# Altium schematic sheet FP_Harness.SchDoc
size A
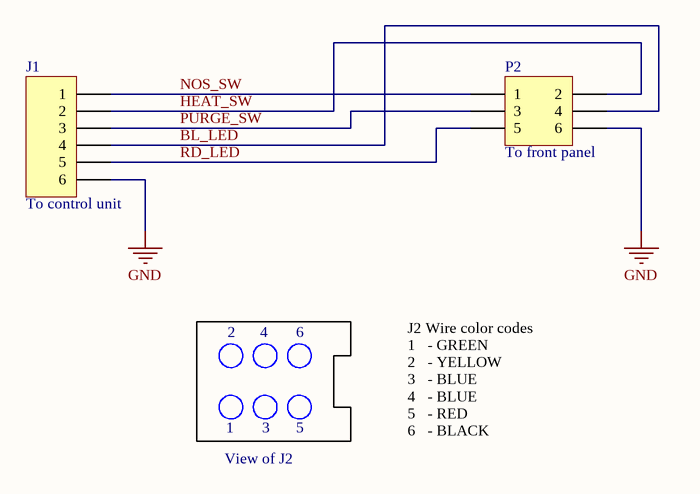
[diagram p0: FP_Harness.SchDoc]

## Parts
J1  To control unit  [MOLEX_5329_6POS_RA]
P2  To front panel  [HDR2X3]

## Nets
GND: J1.6 P2.6
BL_LED: J1.4 P2.4
HEAT_SW: J1.2 P2.2
NOS_SW: J1.1 P2.1
PURGE_SW: J1.3 P2.3
RD_LED: J1.5 P2.5

## Notes on the sheet
- 2
- 4
- 6
- View of J2
- 1
- 3
- 5
- J2 Wire color codes
  1   - GREEN
  2   - YELLOW
  3   - BLUE
  4   - BLUE
  5   - RED
  6   - BLACK

## Library data of the parts
J1 = Header 6: Header, 6-Pin; LatestRevisionDate: 17-Jul-2002; LatestRevisionNote: Re-released for DXP Platform.; Publisher: Altium Limited
P2 = Header 3X2: Header, 3-Pin, Dual row; LatestRevisionDate: 17-Jul-2002; LatestRevisionNote: Re-released for DXP Platform.; Publisher: Altium Limited